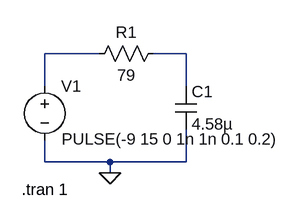
[diagram p0: schematic Draft1.asc]
Draft1.asc, the LTspice schematic file:
Version 4
SHEET 1 880 680
WIRE -144 -224 -224 -224
WIRE -16 -224 -64 -224
WIRE -224 -176 -224 -224
WIRE -16 -176 -16 -224
WIRE -224 -64 -224 -96
WIRE -128 -64 -224 -64
WIRE -16 -64 -16 -112
WIRE -16 -64 -128 -64
WIRE -128 -48 -128 -64
FLAG -128 -48 0
SYMBOL cap -32 -176 R0
SYMATTR InstName C1
SYMATTR Value 4.58µ
SYMBOL res -48 -240 R90
WINDOW 0 0 56 VBottom 2
WINDOW 3 32 56 VTop 2
SYMATTR InstName R1
SYMATTR Value 79
SYMBOL voltage -224 -192 R0
WINDOW 3 25 94 Left 2
WINDOW 123 0 0 Left 0
WINDOW 39 0 0 Left 0
SYMATTR Value PULSE(-9 15 0 1n 1n 0.1 0.2)
SYMATTR InstName V1
TEXT -258 -24 Left 2 !.tran 1

The netlist it stands for:
* Draft1.asc
C1 N002 0 4.58µ
R1 N002 N001 79
V1 N001 0 PULSE(-9 15 0 1n 1n 0.1 0.2)
.tran 1
.backanno
.end